# EAGLE schematic flashcart 02 (EAGLE 5.03)
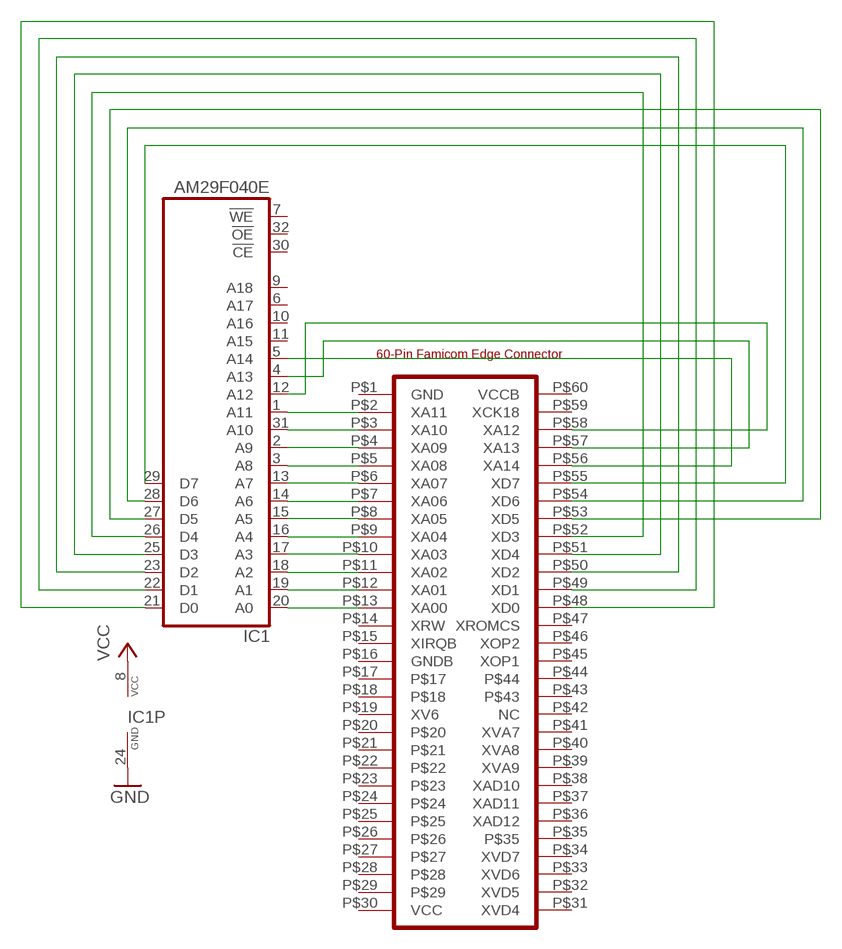
[diagram p0: schematic, sheet 1]

## Parts
IC1  AM29F040E  [TSOP32]
U$1  CART  [CART]

## Nets
GND: IC1.24(GND)
N$1: IC1.20(A0) U$1.P$13(XA00)
N$2: IC1.19(A1) U$1.P$12(XA01)
N$3: IC1.1(A11) U$1.P$2(XA11)
N$4: IC1.31(A10) U$1.P$3(XA10)
N$5: IC1.2(A9) U$1.P$4(XA09)
N$6: IC1.3(A8) U$1.P$5(XA08)
N$7: IC1.13(A7) U$1.P$6(XA07)
N$8: IC1.14(A6) U$1.P$7(XA06)
N$9: IC1.15(A5) U$1.P$8(XA05)
N$10: IC1.16(A4) U$1.P$9(XA04)
N$11: IC1.17(A3) U$1.P$10(XA03)
N$12: IC1.18(A2) U$1.P$11(XA02)
N$13: IC1.29(D7) U$1.P$55(XD7)
N$14: IC1.28(D6) U$1.P$54(XD6)
N$15: IC1.27(D5) U$1.P$53(XD5)
N$16: IC1.26(D4) U$1.P$52(XD3)
N$17: IC1.25(D3) U$1.P$51(XD4)
N$18: IC1.23(D2) U$1.P$50(XD2)
N$19: IC1.22(D1) U$1.P$49(XD1)
N$20: IC1.21(D0) U$1.P$48(XD0)
N$21: IC1.5(A14) U$1.P$56(XA14)
N$22: IC1.4(A13) U$1.P$57(XA13)
N$23: IC1.12(A12) U$1.P$58(XA12)
VCC: IC1.8(VCC)
Unconnected: IC1.6(A17) IC1.7(!WE) IC1.9(A18) IC1.10(A16) IC1.11(A15) IC1.30(!CE) IC1.32(!OE) U$1.P$1(GND) U$1.P$14(XRW) U$1.P$15(XIRQB) U$1.P$16(GNDB) U$1.P$17 U$1.P$18 U$1.P$19(XV6) U$1.P$20 U$1.P$21 U$1.P$22 U$1.P$23 U$1.P$24 U$1.P$25 U$1.P$26 U$1.P$27 U$1.P$28 U$1.P$29 U$1.P$30(VCC) U$1.P$31(XVD4) U$1.P$32(XVD5) U$1.P$33(XVD6) U$1.P$34(XVD7) U$1.P$35 U$1.P$36(XAD12) U$1.P$37(XAD11) U$1.P$38(XAD10) U$1.P$39(XVA9) U$1.P$40(XVA8) U$1.P$41(XVA7) U$1.P$42(NC) U$1.P$43 U$1.P$44 U$1.P$45(XOP1) U$1.P$46(XOP2) U$1.P$47(XROMCS) U$1.P$59(XCK18) U$1.P$60(VCCB)

## Library data of the parts
IC1 = am29-memory:AM29F040E: 4-Megabit FLASH MEMORY (512 K x 8 bit) 5 V-only
U$1 = playpower:CART